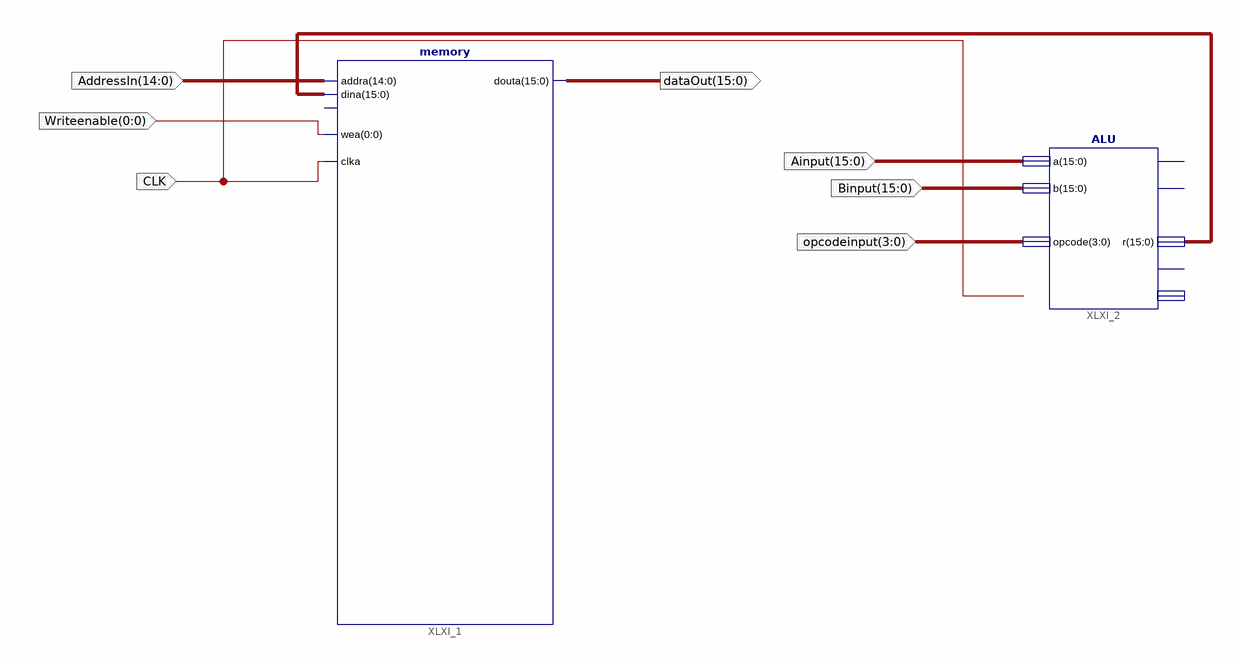
[diagram p0: schematic sheet 1]
// Xilinx ISE schematic Test_ALUMem.sch (spartan3e) as structural Verilog: 2 symbols, 7 ports
module Test_ALUMem (
  input  [15:0] Ainput,
  input  [15:0] Binput,
  input  [3:0] opcodeinput,
  input  CLK,
  input  [14:0] AddressIn,
  input  [0:0] Writeenable,
  output [15:0] dataOut
);

  wire [15:0] XLXN_4;

  memory XLXI_1 (.addra(AddressIn), .dina(XLXN_4), .wea(Writeenable[0]), .clka(CLK), .douta(dataOut));  // open: ena
  ALU XLXI_2 (.a(Ainput), .b(Binput), .opcode(opcodeinput), .r(XLXN_4));  // open: cout, zero, error, compareVal
endmodule
